# Altium schematic sheet MAZ000172 - Diagrama eléctrico.SchDoc: MAZ000172 - Diagrama eléctrico
size A; ApprovedBy: Christian Ledwidth; CheckedBy: Nahuel Martinez; Author: Santiago Marti; CompanyName: Body Health; DrawnBy: Santiago Marti; Revision: A; SheetNumber: 1; SheetTotal: 2
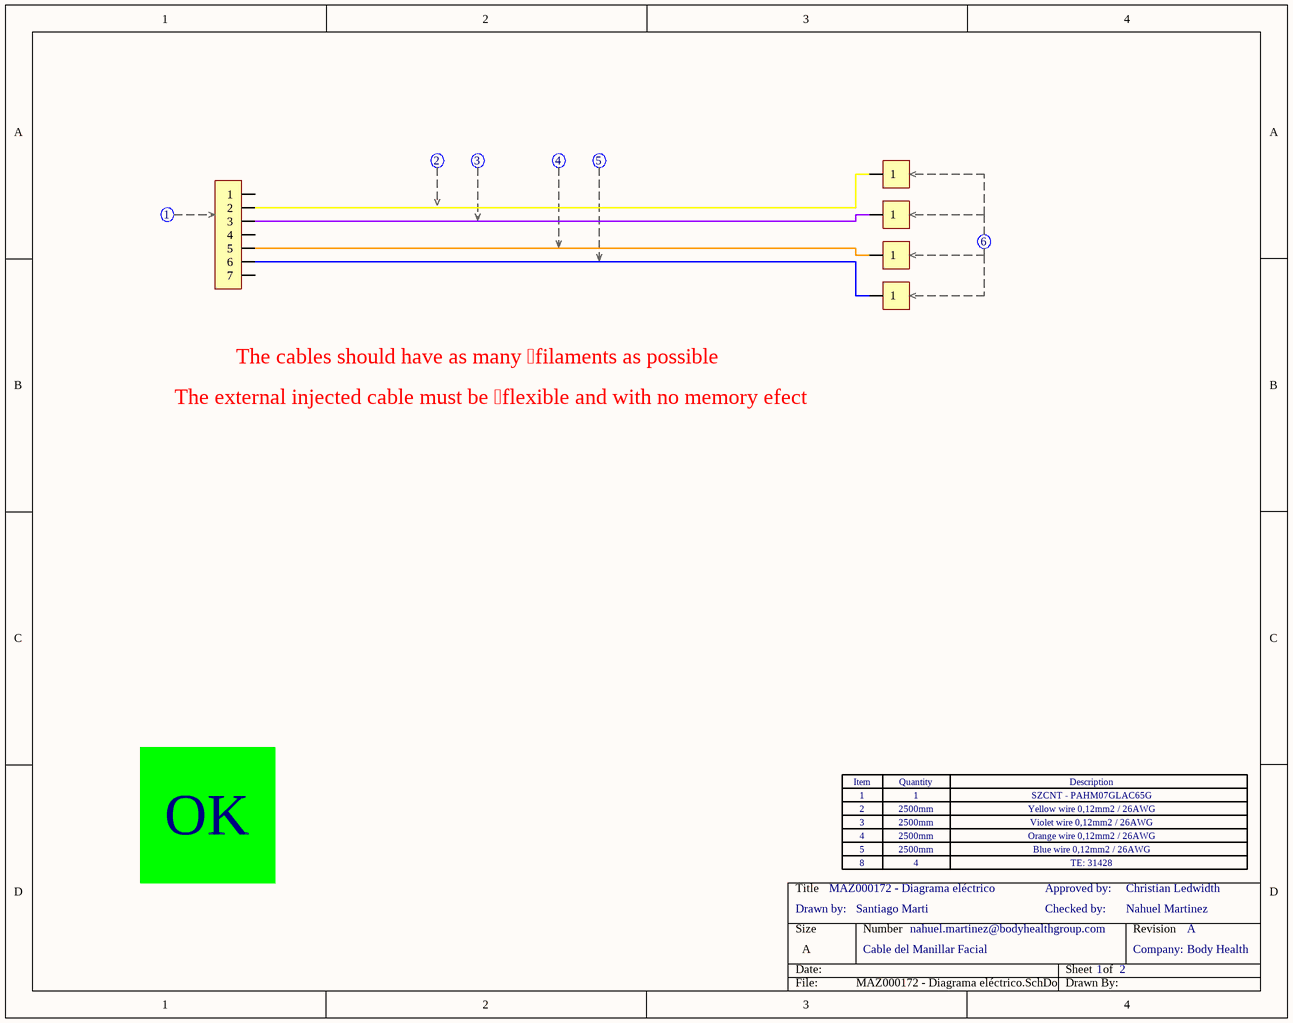
[diagram p0: MAZ000172 - Diagrama eléctrico.SchDoc]

## Parts
(Parts that share a designator on the sheet are numbered #1, #2 ... from top to bottom, then left to right.)
Con?#1  31428  (value not drawn)  (part D of 4)
Con?#2  31428  (value not drawn)  (part D of 4)
Con?#3  31428  (value not drawn)  (part D of 4)
Con?#4  31428  (value not drawn)  (part D of 4)
Conn1  SZCNT_07_Macho  (value not drawn)  (part C of 3)
Conn2  SZCNT_07_Macho  (value not drawn)  (part B of 3)
Conn3  SZCNT_07_Macho  (value not drawn)  (part B of 3)
Conn5  SZCNT_07_Macho  (value not drawn)  (part B of 3)
Conn6  SZCNT_07_Macho  (value not drawn)  (part B of 3)
Conn9  SZCNT_07_Macho  (value not drawn)  (part B of 3)
Conn?  SZCNT_07_Macho  (value not drawn)  (part B of 3)
Zoc1  Zócalo_Header  (value not drawn)
Zoc2  Zócalo_Item  (value not drawn)
Zoc3  Zócalo_Item  (value not drawn)
Zoc4  Zócalo_Item  (value not drawn)
Zoc5  Zócalo_Item  (value not drawn)
Zoc6  Zócalo_Item  (value not drawn)
Zoc9  Zócalo_Item  (value not drawn)

## Nets
NetCon?#1_1: Con?#1.1 Conn1.2
NetCon?#2_1: Con?#2.1 Conn1.3
NetCon?#3_1: Con?#3.1 Conn1.5
NetCon?#4_1: Con?#4.1 Conn1.6

Not connected (* = marked no-connect by the designer): Conn1 1 4 7

## Notes on the sheet
- The cables should have as many filaments as possible
- The external injected cable must be flexible and with no memory efect
- OK
- 1
- 2
- 3
- 4
- 2500mm
- SZCNT - PAHM07GLAC65G
- Yellow wire 0,12mm2 / 26AWG
- Violet wire 0,12mm2 / 26AWG
- Orange wire 0,12mm2 / 26AWG
- Drawn by:
- 5
- 8
- Checked by:
- Approved by:
- Blue wire 0,12mm2 / 26AWG
- TE: 31428
- Cable del Manillar Facial
- nahuel.martinez@bodyhealthgroup.com
- Company:
- (in symbol Zócalo_Header) Item; Quantity; Description

## Library data of the parts
Con?#1-Con?#4 = 31428: CONN RING CIRC 22-26AWG #4 CRIMP; Fabricante: TE Connectivity AMP Connectors; Cod.DigiKey: A27148-ND; Cod.Fabricante: 31428; ComponentLink1Description: Manufacturer Link; ComponentLink1URL: https://www.te.com/commerce/DocumentDelivery/DDEController?Action=srchrtrv&DocNm=31428&DocType=Customer+Drawing&DocLang=English; DIGIKEYx50: -; CallOut: *; DIGIKEYx100: -
Conn1 = SZCNT_07_Macho: Conector SZCNT 7 vías macho para cable; Cod.DigiKey: Se compra a SZCNT; Cod.Fabricante: *; ComponentLink1Description: Manufacturer Link; ComponentLink1URL: *; DIGIKEYx100: *; Fabricante: SZCNT; CallOut: *; DIGIKEYx50: *
Conn2 = SZCNT_07_Macho: Conector SZCNT 7 vías macho para cable; CallOut: 2; Cod.DigiKey: Se compra a SZCNT; Cod.Fabricante: *; ComponentLink1Description: Manufacturer Link; ComponentLink1URL: *; DIGIKEYx100: *; Fabricante: SZCNT; DIGIKEYx50: *
Conn3 = SZCNT_07_Macho: Conector SZCNT 7 vías macho para cable; CallOut: 3; Cod.DigiKey: Se compra a SZCNT; Cod.Fabricante: *; ComponentLink1Description: Manufacturer Link; ComponentLink1URL: *; DIGIKEYx100: *; Fabricante: SZCNT; DIGIKEYx50: *
Conn5 = SZCNT_07_Macho: Conector SZCNT 7 vías macho para cable; CallOut: 4; Cod.DigiKey: Se compra a SZCNT; Cod.Fabricante: *; ComponentLink1Description: Manufacturer Link; ComponentLink1URL: *; DIGIKEYx100: *; Fabricante: SZCNT; DIGIKEYx50: *
Conn6 = SZCNT_07_Macho: Conector SZCNT 7 vías macho para cable; CallOut: 5; Cod.DigiKey: Se compra a SZCNT; Cod.Fabricante: *; ComponentLink1Description: Manufacturer Link; ComponentLink1URL: *; DIGIKEYx100: *; Fabricante: SZCNT; DIGIKEYx50: *
Conn9 = SZCNT_07_Macho: Conector SZCNT 7 vías macho para cable; CallOut: 1; Cod.DigiKey: Se compra a SZCNT; Cod.Fabricante: *; ComponentLink1Description: Manufacturer Link; ComponentLink1URL: *; DIGIKEYx100: *; Fabricante: SZCNT; DIGIKEYx50: *
Conn? = SZCNT_07_Macho: Conector SZCNT 7 vías macho para cable; CallOut: 6; Cod.DigiKey: Se compra a SZCNT; Cod.Fabricante: *; ComponentLink1Description: Manufacturer Link; ComponentLink1URL: *; DIGIKEYx100: *; Fabricante: SZCNT; DIGIKEYx50: *
Zoc1 = Zócalo_Header: Header para el zócalo de referencias
Zoc2-Zoc6 Zoc9 = Zócalo_Item: Ítem para el zócalo de referencias; Desginator: *; Quantity: *; ItemDescription: *